# Altium schematic sheet TP2_EJ1_CIRCUIT2_PCB.SchDoc
size A4
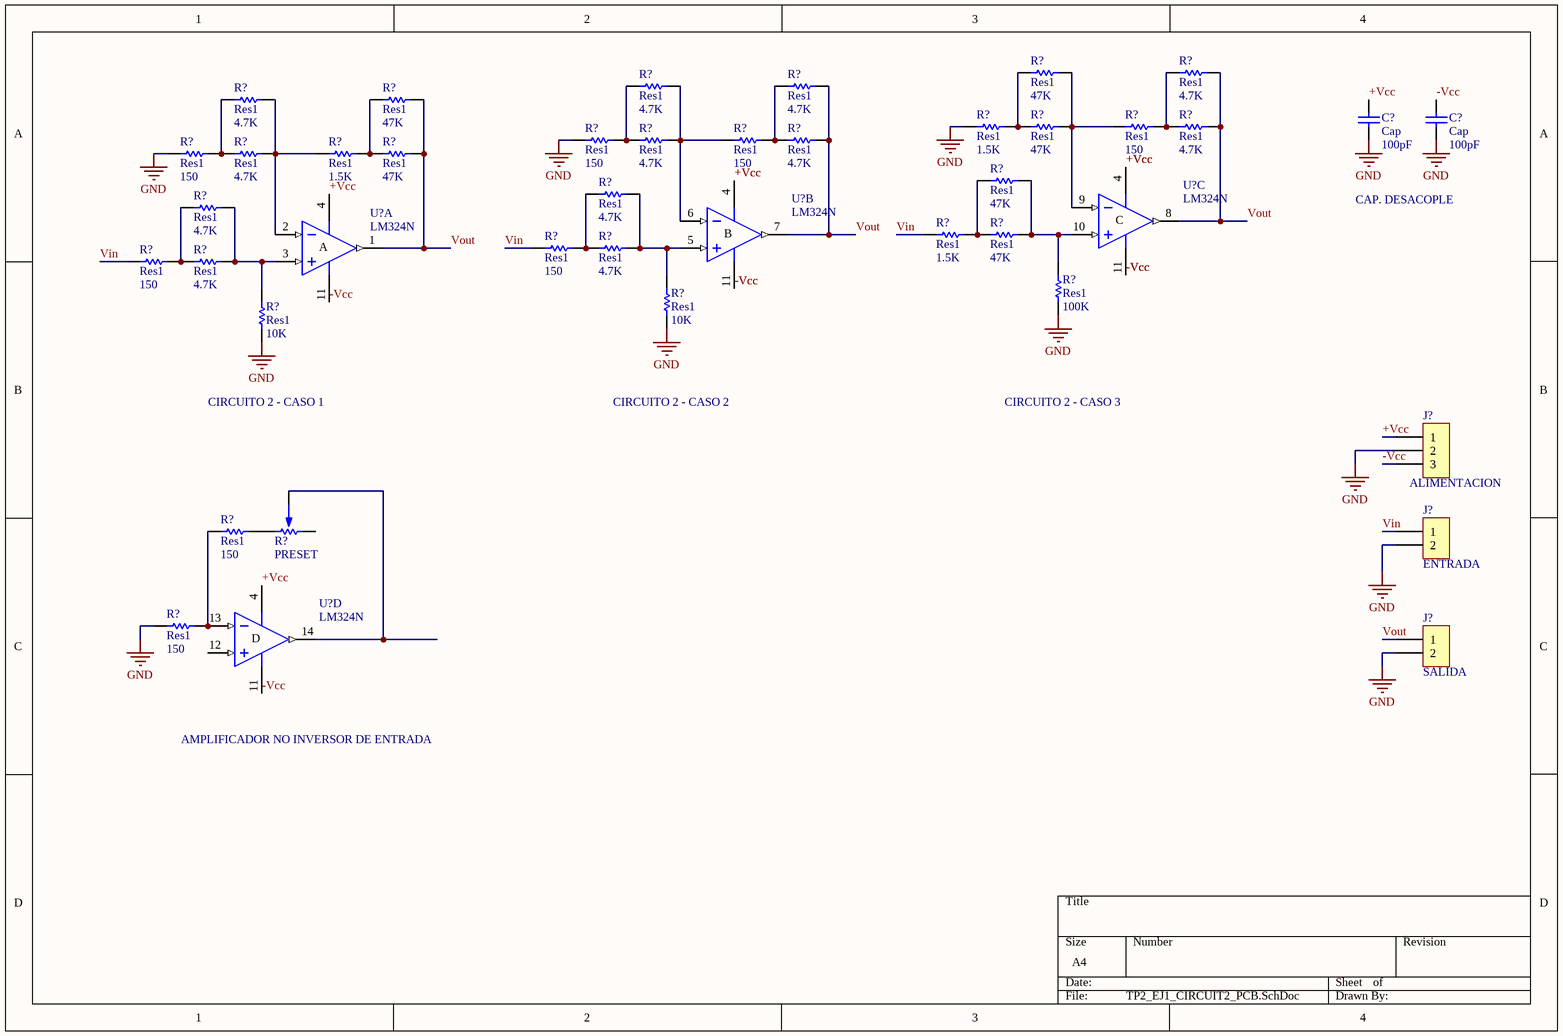
[diagram p0: TP2_EJ1_CIRCUIT2_PCB.SchDoc]

## Parts
(Parts that share a designator on the sheet are numbered #1, #2 ... from top to bottom, then left to right.)
C?#1  Cap  value 100pF  [RAD-0.3]
C?#2  Cap  value 100pF  [RAD-0.3]
J?#1  ALIMENTACION  [BORNERA3]
J?#2  ENTRADA  [BORNERA2]
J?#3  SALIDA  [BORNERA2]
R?#1  Res1  value 47K  [AXIAL-0.3]
R?#2  Res1  value 4.7K  [AXIAL-0.3]
R?#3  Res1  value 4.7K  [AXIAL-0.3]
R?#4  Res1  value 4.7K  [AXIAL-0.3]
R?#5  Res1  value 4.7K  [AXIAL-0.3]
R?#6  Res1  value 47K  [AXIAL-0.3]
R?#7  Res1  value 1.5K  [AXIAL-0.3]
R?#8  Res1  value 47K  [AXIAL-0.3]
R?#9  Res1  value 150  [AXIAL-0.3]
R?#10  Res1  value 4.7K  [AXIAL-0.3]
R?#11  Res1  value 150  [AXIAL-0.3]
R?#12  Res1  value 4.7K  [AXIAL-0.3]
R?#13  Res1  value 150  [AXIAL-0.3]
R?#14  Res1  value 4.7K  [AXIAL-0.3]
R?#15  Res1  value 150  [AXIAL-0.3]
R?#16  Res1  value 4.7K  [AXIAL-0.3]
R?#17  Res1  value 1.5K  [AXIAL-0.3]
R?#18  Res1  value 47K  [AXIAL-0.3]
R?#19  Res1  value 47K  [AXIAL-0.3]
R?#20  Res1  value 4.7K  [AXIAL-0.3]
R?#21  Res1  value 4.7K  [AXIAL-0.3]
R?#22  Res1  value 1.5K  [AXIAL-0.3]
R?#23  Res1  value 47K  [AXIAL-0.3]
R?#24  Res1  value 150  [AXIAL-0.3]
R?#25  Res1  value 4.7K  [AXIAL-0.3]
R?#26  Res1  value 150  [AXIAL-0.3]
R?#27  Res1  value 4.7K  [AXIAL-0.3]
R?#28  Res1  value 100K  [AXIAL-0.3]
R?#29  Res1  value 10K  [AXIAL-0.3]
R?#30  Res1  value 10K  [AXIAL-0.3]
R?#31  Res1  value 150  [AXIAL-0.3]
R?#32  PRESET  [PRESET V]
R?#33  Res1  value 150  [AXIAL-0.3]
U?#1  LM324N  [N014]  (part C of 4)
U?#2  LM324N  [N014]  (part B of 4)
U?#3  LM324N  [N014]  (part A of 4)
U?#4  LM324N  [N014]  (part D of 4)

## Nets
GND: C?#1.1 C?#2.1 J?#1.2 J?#2.2 J?#3.2 R?#7.1 R?#11.1 R?#15.1 R?#28.1 R?#29.1 R?#30.1 R?#33.1
+Vcc: C?#1.2 J?#1.1 U?#1.4(V+) U?#2.4(V+) U?#3.4(V+) U?#4.4(V+)
-Vcc: C?#2.2 J?#1.3 U?#1.11(V-) U?#2.11(V-) U?#3.11(V-) U?#4.11(V-)
Vin: J?#2.1 R?#22.1 R?#24.1 R?#26.1
Vout: J?#3.1 R?#2.2 R?#4.2 R?#6.2 R?#10.2 R?#14.2 R?#18.2 U?#1.8(OUT) U?#2.7(OUT) U?#3.1(OUT)
NetR?#1_1: R?#1.1 R?#7.2 R?#8.1
NetR?#1_2: R?#1.2 R?#8.2 R?#9.1 U?#1.9(IN-)
NetR?#2_1: R?#2.1 R?#9.2 R?#10.1
NetR?#3_1: R?#3.1 R?#11.2 R?#12.1
NetR?#3_2: R?#3.2 R?#12.2 R?#13.1 U?#2.6(IN-)
NetR?#4_1: R?#4.1 R?#13.2 R?#14.1
NetR?#5_1: R?#5.1 R?#15.2 R?#16.1
NetR?#5_2: R?#5.2 R?#16.2 R?#17.1 U?#3.2(IN-)
NetR?#6_1: R?#6.1 R?#17.2 R?#18.1
NetR?#19_1: R?#19.1 R?#22.2 R?#23.1
NetR?#19_2: R?#19.2 R?#23.2 R?#28.2 U?#1.10(IN+)
NetR?#20_1: R?#20.1 R?#24.2 R?#25.1
NetR?#20_2: R?#20.2 R?#25.2 R?#29.2 U?#2.5(IN+)
NetR?#21_1: R?#21.1 R?#26.2 R?#27.1
NetR?#21_2: R?#21.2 R?#27.2 R?#30.2 U?#3.3(IN+)
NetR?#31_1: R?#31.1 R?#33.2 U?#4.13(IN-)
NetR?#31_2: R?#31.2 R?#32.1
NetR?#32_2: R?#32.2 U?#4.14(OUT)

Not connected (* = marked no-connect by the designer): R?#32 3; U?#4 12(IN+)

## Notes on the sheet
- CAP. DESACOPLE
- CIRCUITO 2 - CASO 1
- CIRCUITO 2 - CASO 2
- CIRCUITO 2 - CASO 3
- AMPLIFICADOR NO INVERSOR DE ENTRADA
- (in symbol LM324N, part A) A
- (in symbol LM324N, part B) B
- (in symbol LM324N, part C) C
- (in symbol LM324N, part D) D

## Library data of the parts
C?#1 C?#2 = Cap: Capacitor; Published: 8-Jun-2000; LatestRevisionDate: 17-Jul-2002; LatestRevisionNote: Re-released for DXP Platform.; PackageReference: RAD-0.3; Publisher: Altium Limited; PackageDescription: Radial Cap, Thru-Hole; 2 Leads; 0.3 in Pin Spacing
J?#1 = BORNERA 3
J?#2 J?#3 = BORNERA 2
R?#1-R?#31 R?#33 = Res1: Resistor; Published: 8-Jun-2000; LatestRevisionDate: 17-Jul-2002; LatestRevisionNote: Re-released for DXP Platform.; PackageReference: AXIAL-0.3; Publisher: Altium Limited; PackageDescription: Axial Device, Thru-Hole; 2 Leads; 0.3 in Pin Spacing
U?#1-U?#4 = LM324N: Quadruple Operational Amplifier; Published: 16-Jan-2001; LatestRevisionDate: 04-Mar-2005; LatestRevisionNote: Stylized 3D Model Added.; DatasheetVersion: Feb-1997; PackageVersion: Oct-1995; PackageReference: N014; Publisher: Altium Limited; PackageDescription: DIP; 14 Leads; Row Spacing 7.62 mm; Pitch 2.54 mm; ComponentLink1Description: Manufacturer Link; ComponentLink1URL: http://www.ti.com/; ComponentLink2Description: Datasheet; ComponentLink2URL: http://www-s.ti.com/sc/ds/lm324.pdf